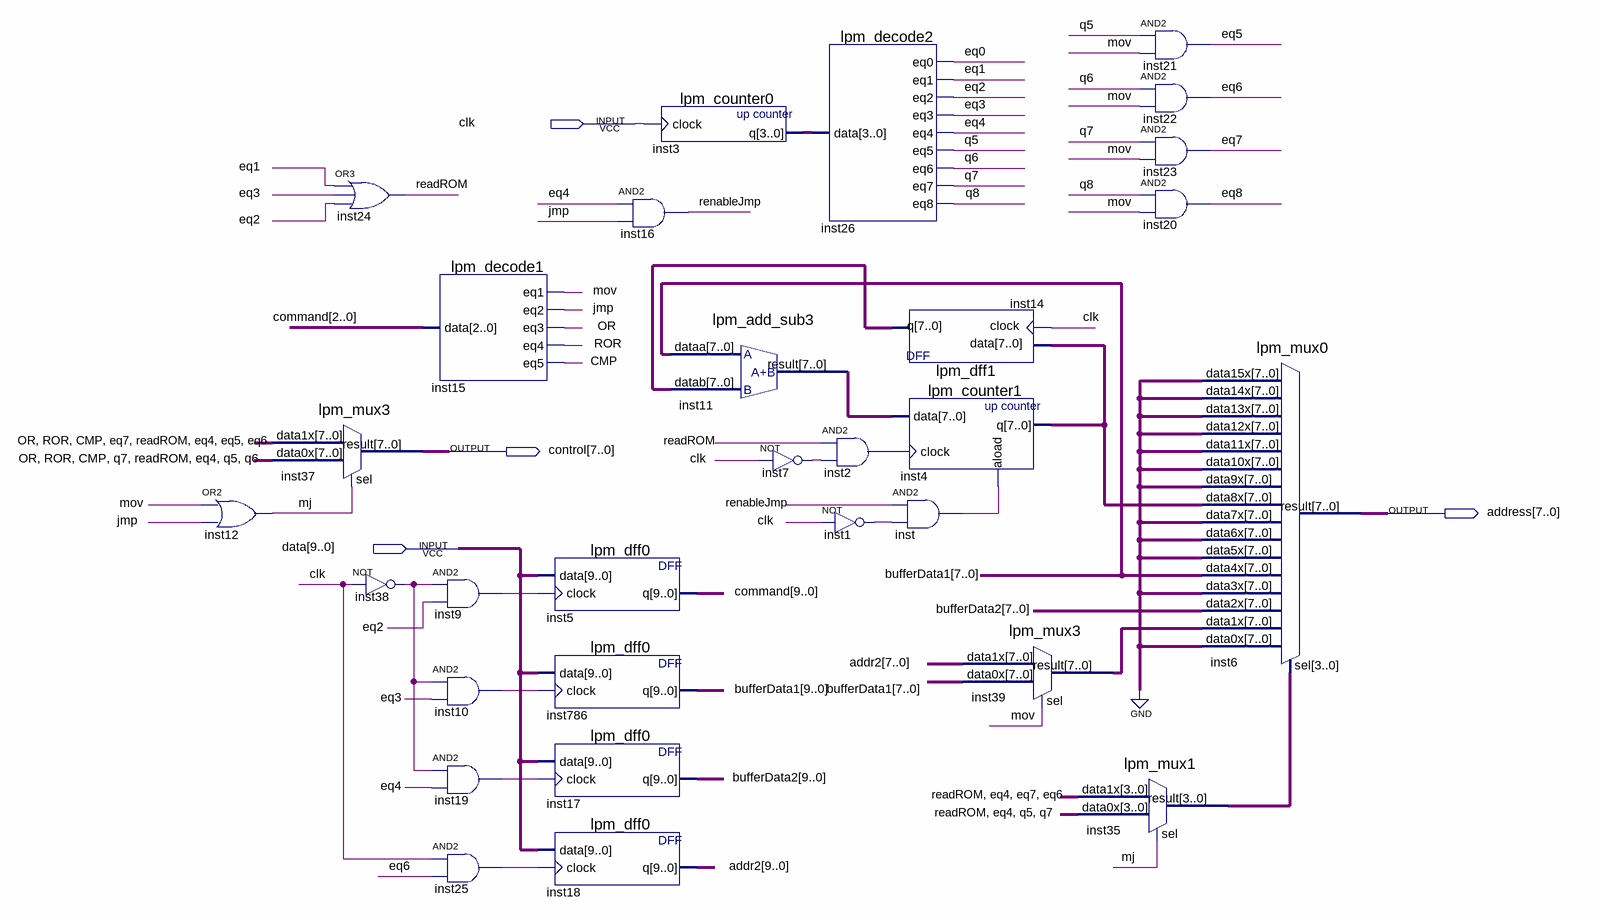
[diagram p0: schematic sheet]
// Quartus schematic device_control.bdf as structural Verilog: 30 symbols, 4 pins
module device_control (
  input  clk,
  input  [9:0] data,
  output [7:0] control,
  output [7:0] address
);

  wire CMP, eq0, eq1, eq2, eq3, eq4, eq5, eq6, eq7, eq8, inst1_out, inst2_out, inst7_out, inst9_out,
       inst10_out, inst19_out, inst25_out, inst38_out, inst_out, jmp, mj, mov, OR, q5, q6, q7, q8, readROM,
       renableJmp, ROR;
  wire [3:0] inst3_q, inst35_result;
  wire [7:0] inst4_q, inst11_result, inst14_q, inst39_result;
  wire [9:0] addr2, bufferData1, bufferData2, command;

  or inst12 (mj, mov, jmp);
  lpm_mux3 inst37 (
    .data1x({OR, ROR, CMP, eq7, readROM, eq4, eq5, eq6}), .data0x({OR, ROR, CMP, q7, readROM, eq4, q5, q6}),
    .sel(mj), .result(control));
  or inst24 (readROM, eq1, eq3, eq2);
  not inst38 (inst38_out, clk);
  lpm_decode1 inst15 (.data(command[2:0]), .eq1(mov), .eq2(jmp), .eq3(OR), .eq4(ROR), .eq5(CMP));
  and inst9 (inst9_out, inst38_out, eq2);
  and inst10 (inst10_out, inst38_out, eq3);
  and inst19 (inst19_out, inst38_out, eq4);
  and inst25 (inst25_out, clk, eq6);
  lpm_dff0 inst5 (.data(data), .clock(inst9_out), .q(command));
  lpm_dff0 inst786 (.data(data), .clock(inst10_out), .q(bufferData1));
  lpm_dff0 inst17 (.data(data), .clock(inst19_out), .q(bufferData2));
  lpm_dff0 inst18 (.data(data), .clock(inst25_out), .q(addr2));
  lpm_counter0 inst3 (.clock(clk), .q(inst3_q));
  and inst16 (renableJmp, eq4, jmp);
  lpm_add_sub3 inst11 (.dataa(bufferData1[7:0]), .datab(inst14_q), .result(inst11_result));
  lpm_decode2 inst26 (
    .data(inst3_q), .eq0(eq0), .eq1(eq1), .eq2(eq2), .eq3(eq3), .eq4(eq4), .eq5(q5), .eq6(q6), .eq7(q7),
    .eq8(q8));
  and inst2 (inst2_out, readROM, inst7_out);
  not inst7 (inst7_out, clk);
  not inst1 (inst1_out, clk);
  lpm_dff1 inst14 (.data(inst4_q), .clock(clk), .q(inst14_q));
  lpm_counter1 inst4 (.data(inst11_result), .clock(inst2_out), .aload(inst_out), .q(inst4_q));
  and inst (inst_out, renableJmp, inst1_out);
  lpm_mux3 inst39 (.data1x(addr2[7:0]), .data0x(bufferData1[7:0]), .sel(mov), .result(inst39_result));
  lpm_mux1 inst35 (
    .data1x({readROM, eq4, eq7, eq6}), .data0x({readROM, eq4, q5, q7}), .sel(mj), .result(inst35_result));
  and inst21 (eq5, q5, mov);
  and inst22 (eq6, q6, mov);
  and inst23 (eq7, q7, mov);
  and inst20 (eq8, q8, mov);
  lpm_mux0 inst6 (
    .data15x({8{1'b0}}), .data14x({8{1'b0}}), .data13x({8{1'b0}}), .data12x({8{1'b0}}), .data11x({8{1'b0}}),
    .data10x({8{1'b0}}), .data9x({8{1'b0}}), .data8x(inst4_q), .data7x({8{1'b0}}), .data6x({8{1'b0}}),
    .data5x({8{1'b0}}), .data4x(bufferData1[7:0]), .data3x({8{1'b0}}), .data2x(bufferData2[7:0]),
    .data1x(inst39_result), .data0x({8{1'b0}}), .sel(inst35_result), .result(address));
endmodule
